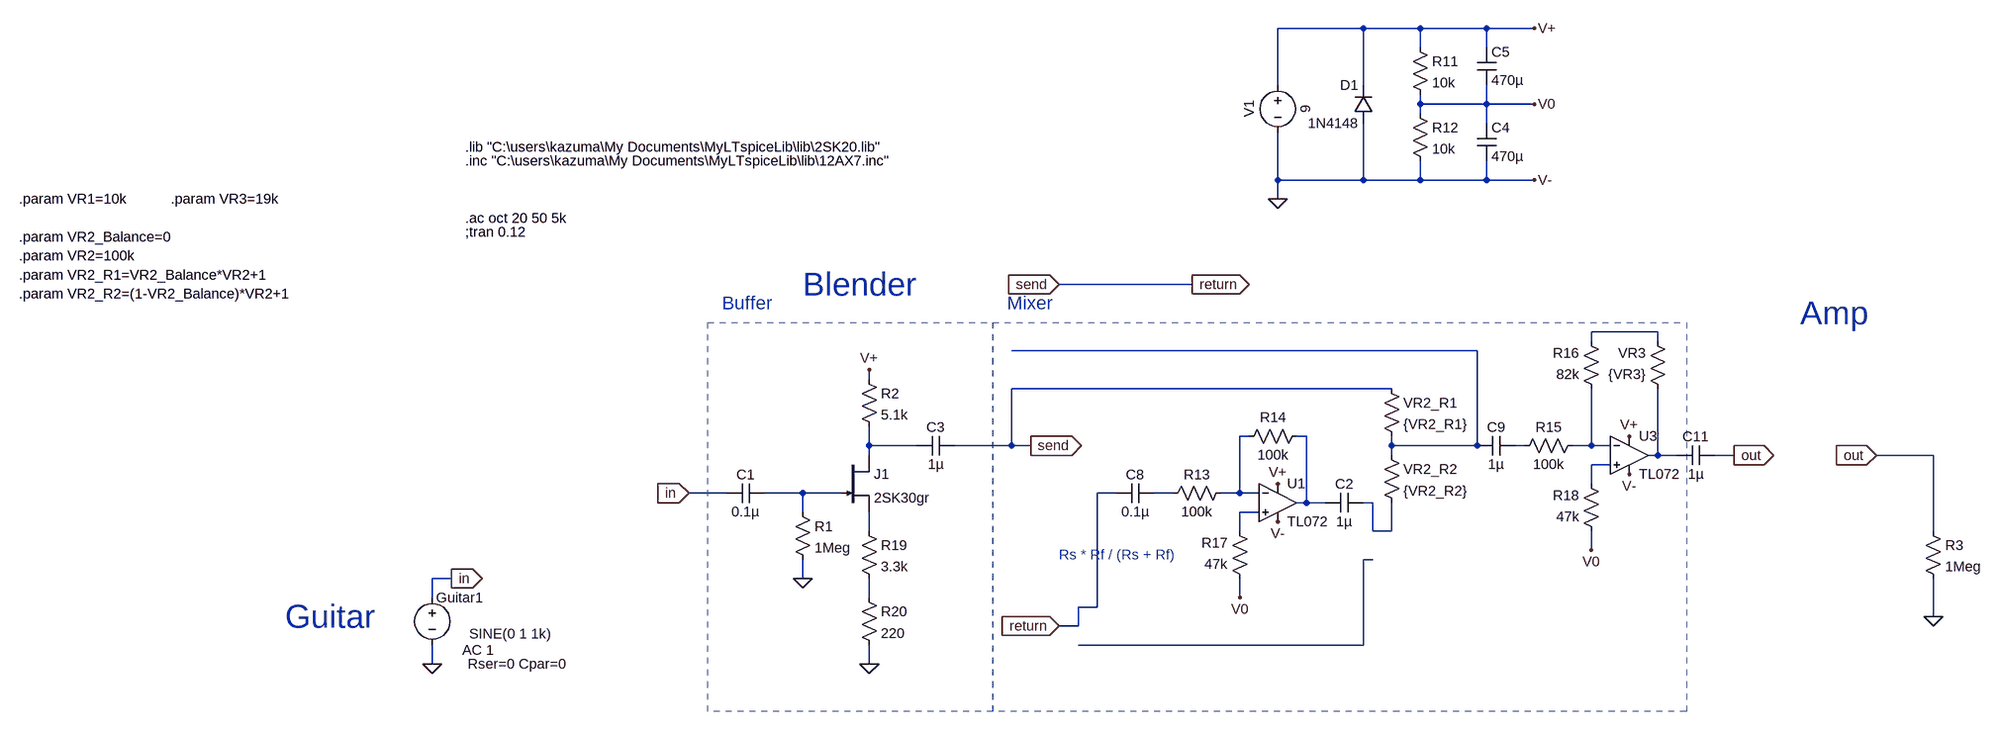
[diagram p0: schematic Blender.asc]
Blender.asc, the LTspice schematic file:
Version 4
SHEET 1 3092 1384
WIRE 1232 -528 1088 -528
WIRE 1328 -528 1232 -528
WIRE 1440 -528 1328 -528
WIRE 1520 -528 1440 -528
WIRE 1328 -496 1328 -528
WIRE 1440 -496 1440 -528
WIRE 1088 -432 1088 -528
WIRE 1232 -432 1232 -528
WIRE 1328 -400 1328 -416
WIRE 1440 -400 1440 -432
WIRE 1440 -400 1328 -400
WIRE 1520 -400 1440 -400
WIRE 1328 -384 1328 -400
WIRE 1440 -368 1440 -400
WIRE 1088 -272 1088 -352
WIRE 1232 -272 1232 -368
WIRE 1232 -272 1088 -272
WIRE 1328 -272 1328 -304
WIRE 1328 -272 1232 -272
WIRE 1440 -272 1440 -304
WIRE 1440 -272 1328 -272
WIRE 1520 -272 1440 -272
WIRE 1088 -240 1088 -272
WIRE 944 -96 720 -96
WIRE 1728 -16 1616 -16
WIRE 1616 0 1616 -16
WIRE 1728 0 1728 -16
WIRE 1424 16 640 16
WIRE 400 64 400 48
WIRE 1280 80 640 80
WIRE 1040 160 1024 160
WIRE 1136 160 1120 160
WIRE 400 176 400 144
WIRE 480 176 400 176
WIRE 640 176 640 80
WIRE 640 176 544 176
WIRE 672 176 640 176
WIRE 1280 176 1280 160
WIRE 1424 176 1424 16
WIRE 1424 176 1280 176
WIRE 1504 176 1488 176
WIRE 1616 176 1616 80
WIRE 1616 176 1584 176
WIRE 1648 176 1616 176
WIRE 400 192 400 176
WIRE 1280 192 1280 176
WIRE 1728 192 1728 80
WIRE 1728 192 1712 192
WIRE 1760 192 1728 192
WIRE 1856 192 1824 192
WIRE 2192 192 2096 192
WIRE 1648 208 1616 208
WIRE 1616 240 1616 208
WIRE 160 256 96 256
WIRE 288 256 224 256
WIRE 352 256 288 256
WIRE 816 256 784 256
WIRE 912 256 880 256
WIRE 1024 256 1024 160
WIRE 1024 256 992 256
WIRE 1056 256 1024 256
WIRE 1136 272 1136 160
WIRE 1136 272 1120 272
WIRE 1168 272 1136 272
WIRE 1248 272 1232 272
WIRE 288 288 288 256
WIRE 1056 288 1024 288
WIRE 400 320 400 288
WIRE 1024 320 1024 288
WIRE 1248 320 1248 272
WIRE 1280 320 1280 272
WIRE 1280 320 1248 320
WIRE 2192 320 2192 192
WIRE 1616 352 1616 320
WIRE 1248 368 1232 368
WIRE -304 400 -336 400
WIRE 288 400 288 368
WIRE -336 432 -336 400
WIRE 400 432 400 400
WIRE 1024 432 1024 400
WIRE 784 448 784 256
WIRE 784 448 752 448
WIRE 2192 464 2192 400
WIRE 752 480 752 448
WIRE 752 480 720 480
WIRE 1232 512 1232 368
WIRE 1232 512 752 512
WIRE -336 544 -336 512
WIRE 400 544 400 512
FLAG 1088 -240 0
FLAG 1520 -528 V+
FLAG 96 256 in
IOPIN 96 256 In
FLAG 672 176 send
IOPIN 672 176 Out
FLAG 720 480 return
IOPIN 720 480 In
FLAG 2096 192 out
IOPIN 2096 192 In
FLAG 2192 464 0
FLAG 1088 304 V-
FLAG 1088 240 V+
FLAG 400 48 V+
FLAG 1856 192 out
IOPIN 1856 192 Out
FLAG 1680 224 V-
FLAG 1680 160 V+
FLAG 1520 -400 V0
FLAG 400 544 0
FLAG 720 -96 send
IOPIN 720 -96 In
FLAG 944 -96 return
IOPIN 944 -96 Out
FLAG 1024 432 V0
FLAG 1616 352 V0
FLAG 288 400 0
FLAG -336 544 0
FLAG -304 400 in
IOPIN -304 400 Out
FLAG 1520 -272 V-
SYMBOL cap 224 240 R90
WINDOW 0 0 32 VBottom 2
WINDOW 3 32 32 VTop 2
SYMATTR InstName C1
SYMATTR Value 0.1µ
SYMBOL res 272 272 R0
SYMATTR InstName R1
SYMATTR Value 1Meg
SYMBOL res 384 48 R0
SYMATTR InstName R2
SYMATTR Value 5.1k
SYMBOL njf 352 192 R0
SYMATTR InstName J1
SYMATTR Value 2SK30gr
SYMBOL res 1264 176 R0
SYMATTR InstName VR2_R2
SYMATTR Value {VR2_R2}
SYMBOL res 1264 64 R0
SYMATTR InstName VR2_R1
SYMATTR Value {VR2_R1}
SYMBOL res 384 304 R0
SYMATTR InstName R19
SYMATTR Value 3.3k
SYMBOL voltage 1088 -448 R0
WINDOW 0 -32 56 VBottom 2
WINDOW 3 32 56 VTop 2
WINDOW 123 0 0 Left 0
WINDOW 39 0 0 Left 0
SYMATTR InstName V1
SYMATTR Value 9
SYMBOL res 2176 304 R0
SYMATTR InstName R3
SYMATTR Value 1Meg
SYMBOL TL072 1088 208 R0
SYMATTR InstName U1
SYMBOL res 1312 -512 R0
SYMATTR InstName R11
SYMATTR Value 10k
SYMBOL res 1312 -400 R0
SYMATTR InstName R12
SYMATTR Value 10k
SYMBOL res 1008 240 R90
WINDOW 0 0 56 VBottom 2
WINDOW 3 32 56 VTop 2
SYMATTR InstName R13
SYMATTR Value 100k
SYMBOL res 1136 144 R90
WINDOW 0 0 56 VBottom 2
WINDOW 3 32 56 VTop 2
SYMATTR InstName R14
SYMATTR Value 100k
SYMBOL TL072 1680 128 R0
SYMATTR InstName U3
SYMBOL res 1600 160 R90
WINDOW 0 0 56 VBottom 2
WINDOW 3 32 56 VTop 2
SYMATTR InstName R15
SYMATTR Value 100k
SYMBOL res 1632 96 R180
WINDOW 0 36 76 Left 2
WINDOW 3 36 40 Left 2
SYMATTR InstName R16
SYMATTR Value 82k
SYMBOL res 1040 416 R180
WINDOW 0 36 76 Left 2
WINDOW 3 36 40 Left 2
SYMATTR InstName R17
SYMATTR Value 47k
SYMBOL res 1632 336 R180
WINDOW 0 36 76 Left 2
WINDOW 3 36 40 Left 2
SYMATTR InstName R18
SYMATTR Value 47k
SYMBOL res 384 416 R0
SYMATTR InstName R20
SYMATTR Value 220
SYMBOL cap 880 240 R90
WINDOW 0 0 32 VBottom 2
WINDOW 3 32 32 VTop 2
SYMATTR InstName C8
SYMATTR Value 0.1µ
SYMBOL cap 1488 160 R90
WINDOW 0 0 32 VBottom 2
WINDOW 3 32 32 VTop 2
SYMATTR InstName C9
SYMATTR Value 1µ
SYMBOL voltage -336 416 R0
WINDOW 0 86 16 Right 2
WINDOW 3 200 77 Right 2
WINDOW 123 104 105 Right 2
WINDOW 39 226 128 Right 2
SYMATTR InstName Guitar1
SYMATTR Value SINE(0 1 1k)
SYMATTR Value2 AC 1
SYMATTR SpiceLine Rser=0 Cpar=0
SYMBOL cap 1824 176 R90
WINDOW 0 0 32 VBottom 2
WINDOW 3 32 32 VTop 2
SYMATTR InstName C11
SYMATTR Value 1µ
SYMBOL cap 1232 256 R90
WINDOW 0 0 32 VBottom 2
WINDOW 3 32 32 VTop 2
SYMATTR InstName C2
SYMATTR Value 1µ
SYMBOL cap 544 160 R90
WINDOW 0 0 32 VBottom 2
WINDOW 3 32 32 VTop 2
SYMATTR InstName C3
SYMATTR Value 1µ
SYMBOL res 1744 96 R180
WINDOW 0 36 76 Left 2
WINDOW 3 36 40 Left 2
SYMATTR InstName VR3
SYMATTR Value {VR3}
SYMBOL cap 1424 -368 R0
SYMATTR InstName C4
SYMATTR Value 470µ
SYMBOL cap 1424 -496 R0
SYMATTR InstName C5
SYMATTR Value 470µ
SYMBOL diode 1248 -368 R180
WINDOW 0 24 64 Left 2
WINDOW 3 24 0 Left 2
SYMATTR InstName D1
SYMATTR Value 1N4148
TEXT -280 -328 Left 2 !.lib "C:\\users\\kazuma\\My Documents\\MyLTspiceLib\\lib\\2SK20.lib"
TEXT 288 -96 Left 5 ;Blender
TEXT 1968 -48 Left 5 ;Amp
TEXT -280 -208 Left 2 !.ac oct 20 50 5k
TEXT -280 -304 Left 2 !.inc "C:\\users\\kazuma\\My Documents\\MyLTspiceLib\\lib\\12AX7.inc"
TEXT -1032 -240 Left 2 !.param VR1=10k
TEXT -1032 -144 Left 2 !.param VR2=100k
TEXT -1032 -112 Left 2 !.param VR2_R1=VR2_Balance*VR2+1
TEXT -1032 -80 Left 2 !.param VR2_R2=(1-VR2_Balance)*VR2+1
TEXT -584 464 Left 5 ;Guitar
TEXT -280 -184 Left 2 !;tran 0.12
TEXT 152 -64 Left 3 ;Buffer
TEXT 632 -64 Left 3 ;Mixer
TEXT -1032 -176 Left 2 !.param VR2_Balance=0
TEXT 720 360 Left 2 ;Rs * Rf / (Rs + Rf)
TEXT -776 -240 Left 2 !.param VR3=19k
RECTANGLE Normal 128 -32 608 624 2
RECTANGLE Normal 1776 624 608 -32 2

The netlist it stands for:
* Blender.asc
C1 N010 in 0.1µ
R1 N010 0 1Meg
R2 V+ N005 5.1k
J1 N005 N010 N014 2SK30gr
R§VR2_R2 N002 N012 {VR2_R2}
R§VR2_R1 return N002 {VR2_R1}
R19 N014 N016 3.3k
V1 V+ 0 9
R3 out 0 1Meg
* U1: TL072 (symbol TL072 not available, pins judged from their places): In+=N013 In-=N003 V+=V+ V-=0 OUT=N004
R11 V+ V0 10k
R12 V0 0 10k
R13 N003 N011 100k
R14 N004 N003 100k
* U3: TL072 (symbol TL072 not available, pins judged from their places): In+=N009 In-=N007 V+=V+ V-=0 OUT=N008
R15 N007 N006 100k
R16 N007 N001 82k
R17 V0 N013 47k
R18 V0 N009 47k
R20 N016 0 220
C8 N011 return 0.1µ
C9 N006 N002 1µ
V§Guitar1 in 0 SINE(0 1 1k) AC 1 Rser=0 Cpar=0
C11 out N008 1µ
C2 N012 N004 1µ
C3 return N005 1µ
R§VR3 N008 N001 {VR3}
C4 V0 0 470µ
C5 V+ V0 470µ
D1 0 V+ 1N4148
.model D D
.lib standard.dio
.model NJF NJF
.model PJF PJF
.lib standard.jft
.lib "C:\users\kazuma\My Documents\MyLTspiceLib\lib\2SK20.lib"
* Blender
* Amp
.ac oct 20 50 5k
.inc "C:\users\kazuma\My Documents\MyLTspiceLib\lib\12AX7.inc"
.param VR1=10k
.param VR2=100k
.param VR2_R1=VR2_Balance*VR2+1
.param VR2_R2=(1-VR2_Balance)*VR2+1
* Guitar
;tran 0.12
* Buffer
* Mixer
.param VR2_Balance=0
* Rs * Rf / (Rs + Rf)
.param VR3=19k
.backanno
.end